# EAGLE design DHT Board-v.1.2 (EAGLE 9.3.0)
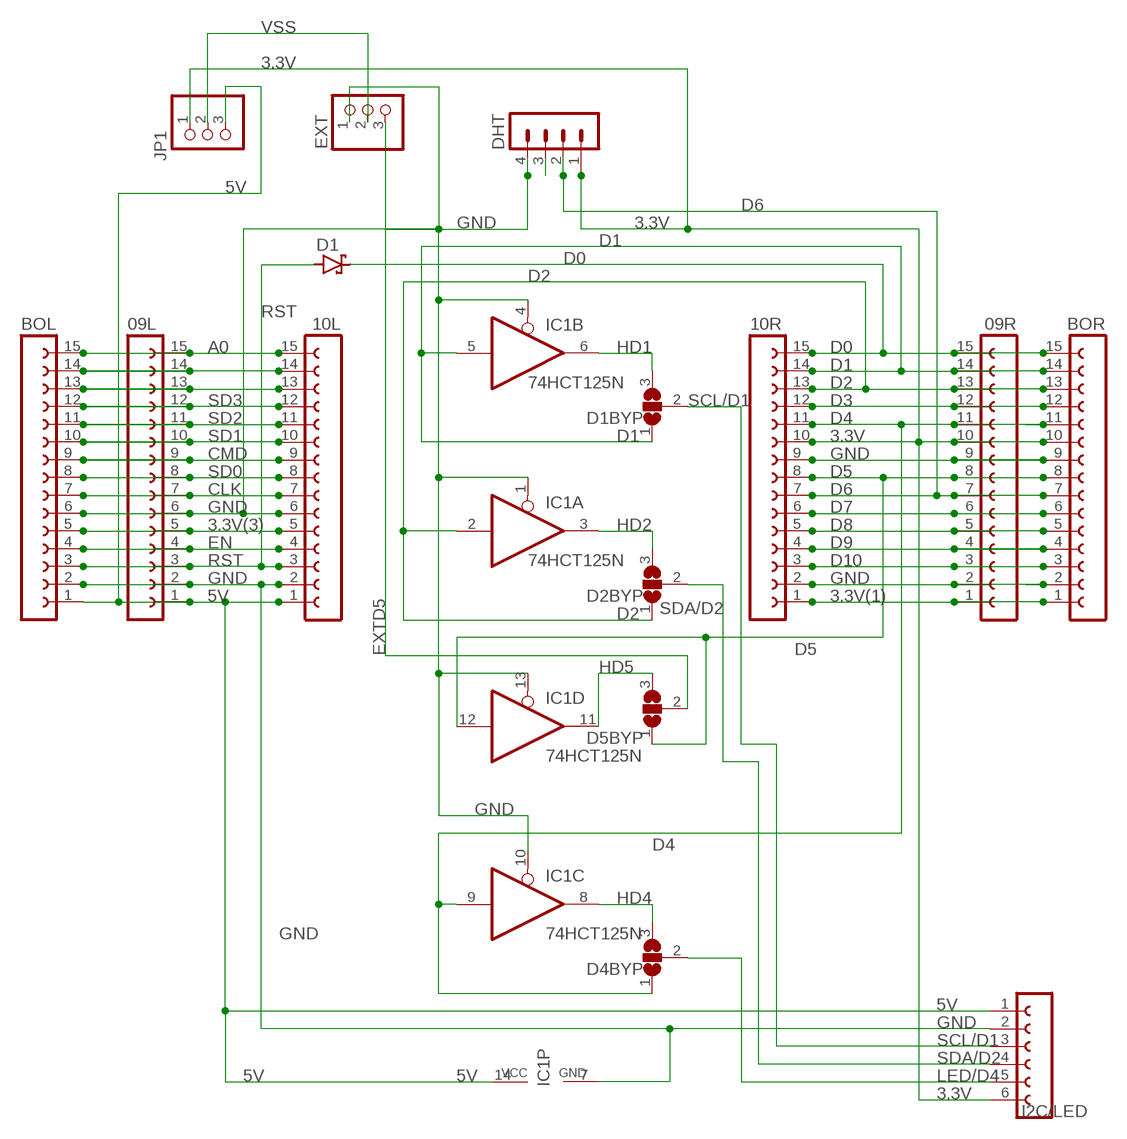
[diagram p0: schematic, sheet 1]

## Parts
09L  15  FE15-1  [FE15]
09R  15  FE15-1  [FE15]
10L  15  FE15-1  [FE15]
10R  15  FE15-1  [FE15]
BOL  15  FE15-1  [FE15]
BOR  15  FE15-1  [FE15]
D1  BAT43  BAT42  [DO35-10]
D1BYP  SJ2W  [SJ_2]
D2BYP  SJ2W  [SJ_2]
D4BYP  SJ2W  [SJ_2]
D5BYP  SJ2W  [SJ_2]
DHT  MA04-1  [MA04-1]
EXT  PINHD-1X3/90  [1X03/90]
I2C/LED  FE06-1  [FE06]
IC1  74HCT125N  [DIL14]
JP1  PINHD-1X3  [1X03]

## Nets
3.3V: 09R.10 10R.10 BOR.10 DHT.1 I2C/LED.6 JP1.1
3.3V(1): 09R.1 10R.1 BOR.1
3.3V(3): 09L.5 10L.5 BOL.5
5V: 09L.1 10L.1 BOL.1 I2C/LED.1 IC1.14(P:VCC) JP1.3
A0: 09L.15 10L.15 BOL.15
CLK: 09L.7 10L.7 BOL.7
CMD: 09L.9 10L.9 BOL.9
D0: 09R.15 10R.15 BOR.15 D1.C
D1: 09R.14 10R.14 BOR.14 D1BYP.1 IC1.5(B:I)
D2: 09R.13 10R.13 BOR.13 D2BYP.1 IC1.2(A:I)
D3: 09R.12 10R.12 BOR.12
D4: 09R.11 10R.11 BOR.11 D4BYP.1 IC1.9(C:I)
D5: 09R.8 10R.8 BOR.8 D5BYP.1 IC1.12(D:I)
D6: 09R.7 10R.7 BOR.7 DHT.2
D7: 09R.6 10R.6 BOR.6
D8: 09R.5 10R.5 BOR.5
D9: 09R.4 10R.4 BOR.4
D10: 09R.3 10R.3 BOR.3
EN: 09L.4 10L.4 BOL.4
EXTD5: D5BYP.2 EXT.3
GND: 09L.2 09L.6 09R.2 09R.9 10L.2 10L.6 10R.2 10R.9 BOL.2 BOL.6 BOR.2 BOR.9 DHT.4 EXT.1 I2C/LED.2 IC1.1(A:OE) IC1.4(B:OE) IC1.7(P:GND) IC1.10(C:OE) IC1.13(D:OE)
HD1: D1BYP.3 IC1.6(B:O)
HD2: D2BYP.3 IC1.3(A:O)
HD4: D4BYP.3 IC1.8(C:O)
HD5: D5BYP.3 IC1.11(D:O)
LED/D4: D4BYP.2 I2C/LED.5
N$1: DHT.3
N$10: 09L.14 10L.14 BOL.14
N$11: 09L.13 10L.13 BOL.13
RST: 09L.3 10L.3 BOL.3 D1.A
SCL/D1: D1BYP.2 I2C/LED.3
SD0: 09L.8 10L.8 BOL.8
SD1: 09L.10 10L.10 BOL.10
SD2: 09L.11 10L.11 BOL.11
SD3: 09L.12 10L.12 BOL.12
SDA/D2: D2BYP.2 I2C/LED.4
VSS: EXT.2 JP1.2

## Library data of the parts
09L 09R 10L 10R BOL BOR = con-lsta:FE15-1: FEMALE HEADER; OC_FARNELL: unknown; OC_NEWARK: unknown
D1 = diode:BAT42: DIODE barrier diode
D1BYP D2BYP D4BYP D5BYP = jumper:SJ2W: SMD solder JUMPER
DHT = con-lstb:MA04-1: PIN HEADER; OC_FARNELL: unknown; OC_NEWARK: unknown
EXT JP1 = pinhead:PINHD-1X3: PIN HEADER
I2C/LED = con-lsta:FE06-1: FEMALE HEADER; OC_FARNELL: unknown; OC_NEWARK: unknown
IC1 = 74xx-eu:74*125: Quad bus BUFFER, 3-state

## Board
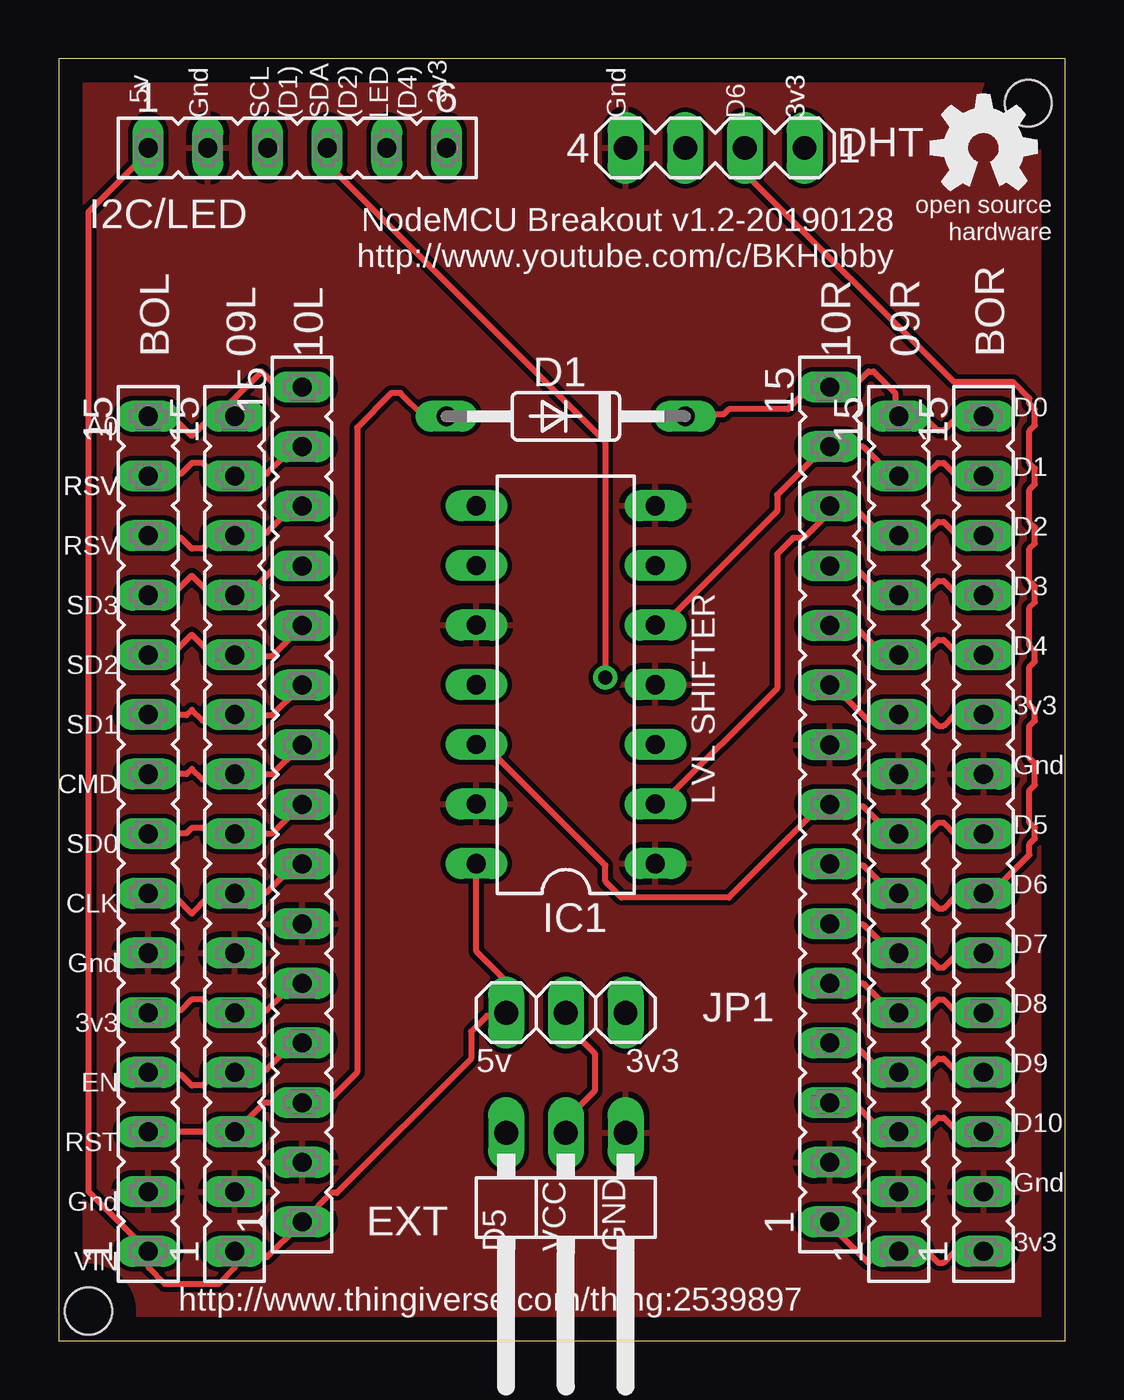
[diagram p1: board, top side]
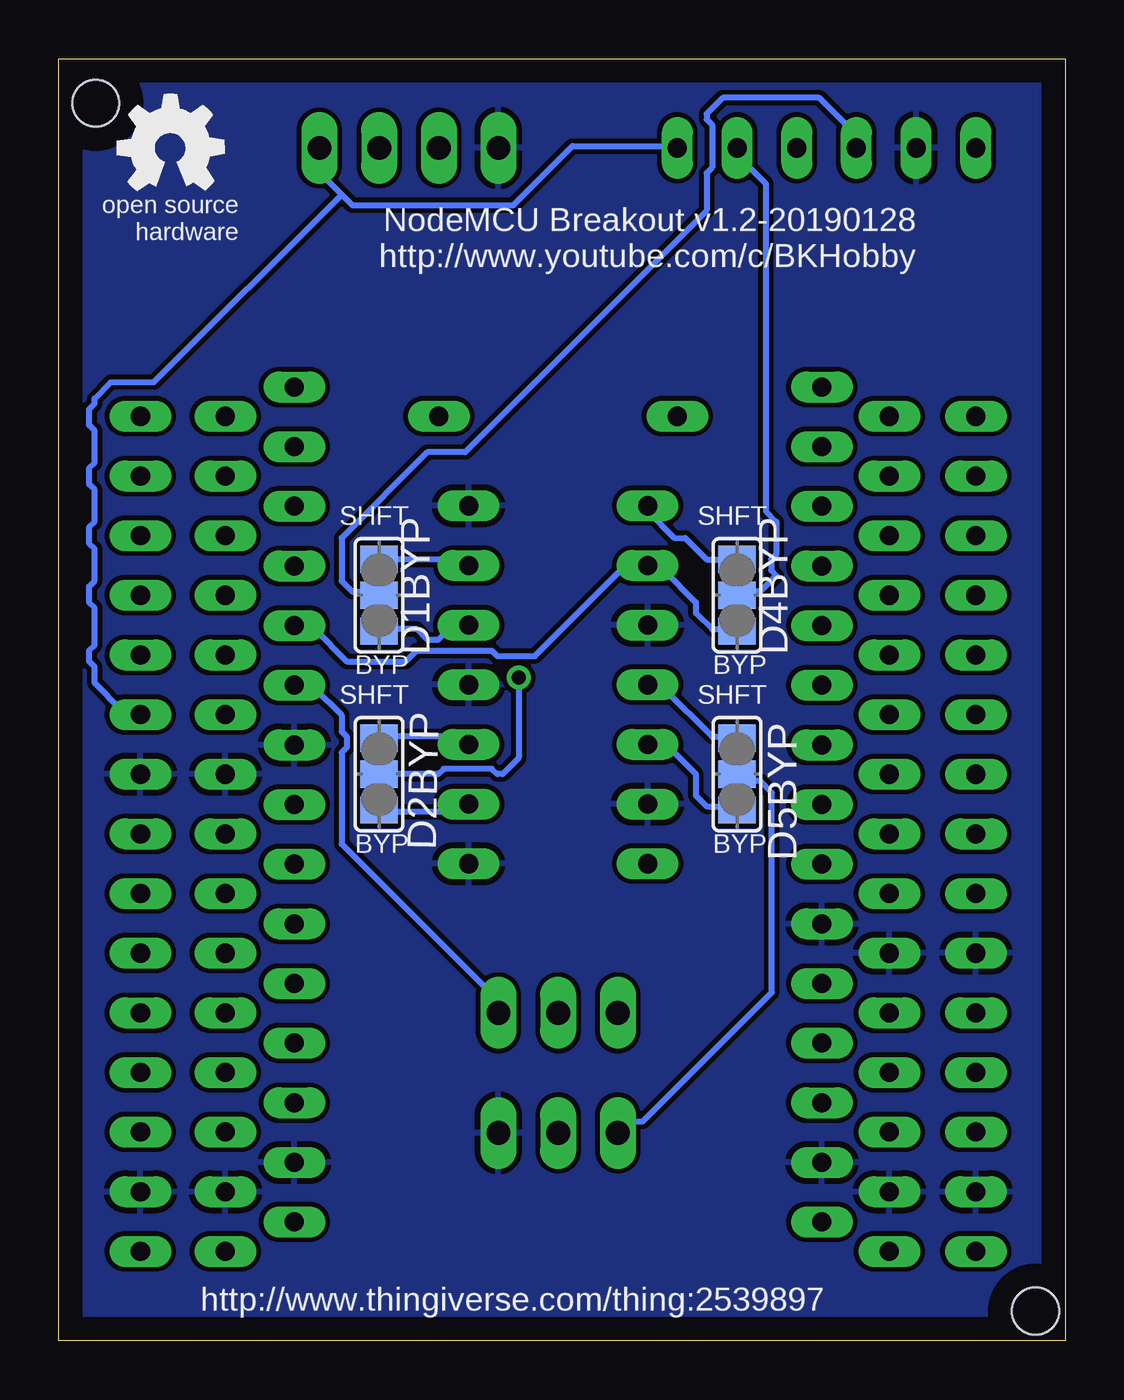
[diagram p2: board, bottom side, seen from below]

Size 42.85 x 54.6 mm. Coordinates in mm from the lower left corner, seen from the top.
Outline: 0,0 42.85,0 42.85,54.6 0,54.6 0,0
Copper layers (1*16): Top 0.035mm / dielectric 1.5mm / Bottom 0.035mm
Design rules "default": minimum track width 10mil, minimum drill 24mil, track to track 8mil, track to pad 8mil, pad to pad 8mil, via to via 8mil, smd to smd 8mil, copper to edge 40mil, drill to drill 8mil, minimum pad ring 10mil, minimum via ring 8mil, stop-mask expansion 4mil, vias tented up to drill 0mil, thermal gap 10mil
Holes 2 mm at 41.27,52.7 1.27,1.27

### Footprints (pad centres in the part's own frame; a part is rotated, then mirrored left to right if it is on the bottom)
FE15 = drill 0.813 long: 1 -17.78,0; 2 -15.24,0; 3 -12.7,0; 4 -10.16,0; 5 -7.62,0; 6 -5.08,0; 7 -2.54,0; 8 0,0; 9 2.54,0; 10 5.08,0; 11 7.62,0; 12 10.16,0; 13 12.7,0; 14 15.24,0; 15 17.78,0
DO35-10 = drill 0.813 long: A 5.08,0; C -5.08,0
SJ_2 = smd 1.168 x 1.6: 1 -1.524,0; 2 0,0; 3 1.524,0
MA04-1 = drill 1.016 long: 1 -3.81,0; 2 -1.27,0; 3 1.27,0; 4 3.81,0
1X03/90 = drill 1.016 long: 1 -2.54,-3.81; 2 0,-3.81; 3 2.54,-3.81
FE06 = drill 0.813 long: 1 -6.35,0; 2 -3.81,0; 3 -1.27,0; 4 1.27,0; 5 3.81,0; 6 6.35,0
DIL14 = drill 0.813 long: 1 -7.62,-3.81; 2 -5.08,-3.81; 3 -2.54,-3.81; 4 0,-3.81; 5 2.54,-3.81; 6 5.08,-3.81; 7 7.62,-3.81; 8 7.62,3.81; 9 5.08,3.81; 10 2.54,3.81; 11 0,3.81; 12 -2.54,3.81; 13 -5.08,3.81; 14 -7.62,3.81
1X03 = drill 1.016 long: 1 -2.54,0; 2 0,0; 3 2.54,0

### Placement (x,y rotation side)
09L  7.49,21.59 90 top
09R  35.76,21.59 90 top
10L  10.36,22.84 90 top
10R  32.82,22.84 90 top
BOL  3.81,21.59 90 top
BOR  39.37,21.59 90 top
D1  21.59,39.37 180 top
D1BYP  29.21,31.75 90 bottom
D2BYP  29.21,24.13 90 bottom
D4BYP  13.97,31.75 90 bottom
D5BYP  13.97,24.13 90 bottom
DHT  27.94,50.8 180 top
EXT  21.59,5.04 180 top
I2C/LED  10.16,50.8 0 top
IC1  21.59,27.94 90 top
JP1  21.59,13.97 180 top
U$1  [OSHW_5MM]  39.37,50.8 0 top
U$2  [OSHW_5MM]  38.1,50.8 0 bottom

### Tracks (layer width: path | path; a pad name or v marks a point on that pad's centre or on a via)
3.3V
  Top 0.254: 10R.10 32.87,27.79 33.1,27.79 34.47,26.42 35.38,26.42 35.61,26.64 09R.10 35.84,26.64 36.98,26.64 37.44,26.19 37.67,26.19 38.12,26.64 39.27,26.64 BOR.10
  Bottom 0.254: 30.81,48.82 31.72,49.73 31.72,50.65 DHT.1 | 30.81,48.82 30.35,48.36 23.5,48.36 20.98,50.88 16.64,50.88 I2C/LED.6 | JP1.1 24.18,14.07 24.18,14.53 30.81,21.16 30.81,25.04 30.58,25.27 30.58,25.73 30.81,25.96 30.81,26.64 31.95,27.79 32.64,27.79 10R.10 | 30.81,48.82 38.81,40.82 40.64,40.82 41.33,40.13 41.33,39.9 41.55,39.67 41.55,38.99 41.33,38.76 41.33,37.39 41.55,37.16 41.55,36.47 41.33,36.25 41.33,34.87 41.55,34.65 41.55,33.96 41.33,33.73 41.33,32.36 41.55,32.13 41.55,31.44 41.33,31.22 41.33,29.62 41.55,29.39 41.55,28.93 41.33,28.7 41.33,28.02 40.18,26.87 39.5,26.87 BOR.10
3.3V(1)
  Top 0.254: 10R.1 32.87,4.93 34.47,3.33 34.92,3.79 35.61,3.79 09R.1 35.84,3.79 36.98,3.79 37.44,3.33 37.67,3.33 38.12,3.79 39.27,3.79 BOR.1
3.3V(3)
  Top 0.254: BOL.5 3.83,14.07 5.21,14.07 5.66,14.53 6.12,14.53 6.58,14.07 7.26,14.07 09L.5 7.49,14.07 8.86,14.07 9.55,14.76 9.78,14.76 10.24,15.21 10L.5
5V
  Top 0.254: 7.49,3.79 7.49,3.1 6.81,2.41 4.52,2.41 3.83,3.1 3.83,3.79 BOL.1 1.27,6.35 1.27,48.08 3.83,50.65 | 7.49,3.79 8.64,3.79 8.86,3.56 10.24,4.93 10L.1 10.46,5.16 11.61,6.3 11.84,6.3 17.55,12.01 17.55,13.16 18.24,13.84 18.92,13.84 JP1.3 18.92,14.07 18.92,15.44 17.78,16.59 IC1.14 17.78,20.47 16.64,20.47 | 7.49,3.79 09L.1 | 3.83,50.65 4.29,50.19 4.29,49.96 | 3.83,50.65 I2C/LED.1
A0
  Top 0.254: BOL.15 3.83,39.22 4.98,39.22 5.66,38.53 6.35,39.22 7.26,39.22 09L.15 7.26,39.45 7.26,39.9 8.64,41.28 9.09,40.82 10.24,40.82 10L.15
CLK
  Top 0.254: BOL.7 3.83,18.87 4.98,18.87 5.66,18.19 6.35,18.87 7.26,18.87 09L.7 7.49,19.1 8.86,19.1 9.55,19.79 9.78,19.79 10.24,20.24 10L.7
CMD
  Top 0.254: BOL.9 5.44,24.13 5.66,24.36 6.12,23.9 7.04,23.9 7.26,24.13 09L.9 9.09,24.13 10.24,25.27 10L.9
D0
  Top 0.254: BOR.15 39.27,39.22 38.12,39.22 37.67,38.76 37.44,38.76 36.98,39.22 35.84,39.22 09R.15 35.61,39.45 35.61,40.36 34.7,41.28 34.47,41.28 34.01,40.82 32.87,40.82 10R.15 32.64,40.59 31.95,40.59 31.04,39.67 28.52,39.67 28.3,39.45 26.69,39.45 D1.C
D1
  Top 0.254: BOR.14 39.27,36.93 38.12,36.93 37.67,37.39 37.44,37.39 36.98,36.93 35.84,36.93 09R.14 35.61,36.7 34.24,38.08 32.87,38.08 10R.14 32.64,38.08 30.58,36.02 30.58,35.33 26.24,30.99 26.01,30.99 25.55,30.53 IC1.5
  Bottom 0.254: D1BYP.1 29.21,30.3 27.61,30.3 27.15,29.85 26.69,29.85 26.24,30.3 25.55,30.3 IC1.5
D2
  Top 0.254: 32.87,35.33 34.01,35.33 34.92,34.42 35.61,34.42 09R.13 35.84,34.42 36.98,34.42 37.44,34.87 37.67,34.87 38.12,34.42 39.27,34.42 BOR.13 | 32.87,35.33 31.72,34.19 31.27,34.19 30.58,33.5 30.58,27.79 25.78,22.99 25.55,22.99 IC1.2 | 32.87,35.33 10R.13
  Bottom 0.254: D2BYP.1 29.21,22.53 25.78,22.53 25.55,22.76 IC1.2
D3
  Top 0.254: 10R.12 32.87,32.82 34.01,32.82 34.92,31.9 35.61,31.9 09R.12 35.84,31.9 36.98,31.9 37.44,32.36 37.67,32.36 38.12,31.9 39.27,31.9 BOR.12
D4
  Top 0.254: 10R.11 32.87,30.3 34.01,30.3 34.92,29.39 35.61,29.39 09R.11 35.84,29.39 36.98,29.39 37.44,29.85 37.67,29.85 38.12,29.39 39.27,29.39 BOR.11
  Bottom 0.254: 17.78,32.82 17.09,32.82 15.72,31.44 15.72,30.99 15.04,30.3 14.12,30.3 D4BYP.1 | 17.78,32.82 18.92,32.82 22.58,29.16 24.18,29.16 24.41,29.39 27.61,29.39 28.07,28.93 30.58,28.93 31.95,30.3 32.64,30.3 10R.11 | 17.78,32.82 IC1.9
D5
  Top 0.254: BOR.8 39.27,21.61 38.12,21.61 37.67,22.07 37.44,22.07 36.98,21.61 35.84,21.61 09R.8 35.61,21.39 34.24,22.76 32.87,22.76 10R.8 32.64,22.99 28.52,18.87 23.95,18.87 23.27,19.56 23.27,20.24 18.24,25.27 17.78,25.27 IC1.12
  Bottom 0.254: D5BYP.1 14.12,22.76 15.26,22.76 15.72,23.22 15.72,24.13 16.87,25.27 17.78,25.27 IC1.12
D6
  Top 0.254: 10R.7 32.87,20.24 34.24,20.24 35.61,18.87 09R.7 35.84,18.87 36.98,18.87 37.44,18.41 37.67,18.41 38.12,18.87 39.27,18.87 BOR.7 39.5,18.87 41.33,20.7 41.33,21.16 41.55,21.39 41.55,21.84 41.33,22.07 41.33,23.44 41.55,23.67 41.55,24.59 41.33,24.82 41.33,26.19 41.55,26.42 41.55,26.87 41.33,27.1 41.33,28.7 41.55,28.93 41.55,29.39 41.33,29.62 41.33,31.22 41.55,31.44 41.55,32.13 41.33,32.36 41.33,33.73 41.55,33.96 41.55,34.65 41.33,34.87 41.33,36.25 41.55,36.47 41.55,37.16 41.33,37.39 41.33,38.76 41.55,38.99 41.55,39.67 41.33,39.9 41.33,40.13 40.64,40.82 38.12,40.82 29.21,49.73 DHT.2
D7
  Top 0.254: 10R.6 32.87,17.73 34.24,17.73 35.61,16.36 09R.6 35.84,16.36 36.98,16.36 37.44,15.9 37.67,15.9 38.12,16.36 39.27,16.36 BOR.6
D8
  Top 0.254: 10R.5 32.87,15.21 34.24,15.21 35.61,13.84 09R.5 35.84,14.07 36.98,14.07 37.44,14.53 37.67,14.53 38.12,14.07 39.27,14.07 BOR.5
D9
  Top 0.254: 10R.4 32.87,12.47 34.01,12.47 34.92,11.56 35.61,11.56 09R.4 35.84,11.56 36.98,11.56 37.44,12.01 37.67,12.01 38.12,11.56 39.27,11.56 BOR.4
D10
  Top 0.254: 10R.3 32.87,9.96 34.01,9.96 34.92,9.04 35.61,9.04 09R.3 35.84,9.04 36.98,9.04 37.44,9.5 37.67,9.5 38.12,9.04 39.27,9.04 BOR.3
EN
  Top 0.254: BOL.4 3.83,11.33 5.21,11.33 5.66,10.87 6.12,10.87 6.58,11.33 7.26,11.33 09L.4 7.49,11.56 8.86,11.56 9.78,12.47 10.24,12.47 10L.4
EXTD5
  Bottom 0.254: D5BYP.2 13.49,23.84 12.99,23.84 12.49,23.34 12.49,14.84 17.99,9.34 18.99,9.34 EXT.3
GND
  pour Top: 0,0 0,54.61 43.18,54.61 43.18,0
  pour Bottom: 0,0 0,54.61 43.18,54.61 43.18,0
HD1
  Bottom 0.254: D1BYP.3 25.78,33.27 25.55,33.05 IC1.6
HD2
  Bottom 0.254: D2BYP.3 29.21,25.73 25.78,25.73 25.55,25.5 IC1.3
HD4
  Bottom 0.254: D4BYP.3 15.26,33.27 16.18,34.19 16.64,34.19 17.78,35.33 IC1.8
HD5
  Bottom 0.254: D5BYP.3 14.12,25.73 15.04,25.73 17.09,27.79 17.78,27.79 IC1.11
LED/D4
  Bottom 0.254: D4BYP.2 13.89,31.9 12.98,31.9 12.29,32.59 12.52,32.82 12.52,33.27 12.29,33.5 12.29,34.87 12.75,35.33 12.75,49.28 14.12,50.65 I2C/LED.5
N$10
  Top 0.254: BOL.14 3.83,36.93 5.21,36.93 5.66,37.39 6.12,37.39 6.58,36.93 7.26,36.93 09L.14 7.49,36.93 8.86,36.93 9.55,37.62 9.78,37.62 10.24,38.08 10L.14
N$11
  Top 0.254: BOL.13 3.83,34.19 5.21,34.19 5.66,33.73 6.12,33.73 6.58,34.19 7.26,34.19 09L.13 7.49,34.42 8.86,34.42 9.78,35.33 10.24,35.33 10L.13
RST
  Top 0.254: D1.A 15.53,39.37 14.54,40.36 14.16,40.36 12.7,38.9 12.7,11.43 11.41,10.14 10L.3 8.74,10.14 09L.3 BOL.3
SCL/D1
  Bottom 0.254: D1BYP.2 29.21,31.9 30.35,31.9 30.81,32.36 30.81,34.19 27.15,37.85 25.55,37.85 15.26,48.13 15.26,49.73 15.04,49.96 15.04,51.79 15.26,52.02 15.26,52.25 14.58,52.93 10.46,52.93 9.09,51.56 9.09,50.88 I2C/LED.3
SD0
  Top 0.254: BOL.8 3.83,21.61 5.44,21.61 5.66,21.84 6.12,21.84 6.35,21.61 7.26,21.61 09L.8 7.49,21.61 9.09,21.61 10.24,22.76 10L.8
SD1
  Top 0.254: BOL.10 3.83,26.64 5.44,26.64 5.66,26.87 6.12,26.42 6.35,26.64 7.26,26.64 09L.10 7.49,26.64 9.09,26.64 10.24,27.79 10L.10
SD2
  Top 0.254: BOL.11 3.83,29.39 4.98,29.39 5.66,30.07 6.35,29.39 7.26,29.39 09L.11 7.49,29.16 9.09,29.16 10.24,30.3 10L.11
SD3
  Top 0.254: BOL.12 3.83,31.9 4.98,31.9 5.66,32.59 6.35,31.9 7.26,31.9 09L.12 7.49,31.9 8.18,31.9 9.09,32.82 10.24,32.82 10L.12
SDA/D2  (via drill 0.61)
  Top 0.254: v23.27,28.25 23.27,38.3 11.61,49.96 11.61,50.65 I2C/LED.4
  Bottom 0.254: D2BYP.2 26.69,24.13 26.47,24.36 24.41,24.36 24.18,24.13 23.95,24.13 23.27,24.82 v23.27,28.25
VSS
  Top 0.254: EXT.2 21.67,9.04 21.67,9.5 22.81,10.64 22.81,12.24 21.67,13.39 21.67,13.84 JP1.2

### Text on the board
tNames: 5v | 3v3 | Gnd | SCL / (D1) | SDA / (D2) | LED / (D4) | Gnd | D6 | 3v3 | 3v3 | NodeMCU Breakout v1.2-20190128 / http://www.youtube.com/c/BKHobby | A0 | D0 | RSV | RSV | D1 | RSV | D2 | SD3 | D3 | SD2 | D4 | SD1 | 3v3 | CMD | Gnd | LVL SHIFTER | SD0 | D5 | CLK | D6 | Gnd | D7 | 3v3 | D8 | EN | 5v | 3v3 | D9 | RST | D10 | Gnd | Gnd | VIN | D5 | VCC | GND | 3v3 | http://www.thingiverse.com/thing:2539897
bNames: NodeMCU Breakout v1.2-20190128 / http://www.youtube.com/c/BKHobby | SHFT | SHFT | BYP | BYP | SHFT | SHFT | BYP | BYP | http://www.thingiverse.com/thing:2539897